# EasyEDA Pro project AB_Register.eprj

# Schematic Schematic2
Board Name: Board2; Create Date: 2025-08-15; Page Name: P1; Project Name: AB_Register; Schematic Name: Schematic2; Update Date: 2025-08-15; Company: EasyEDA.com; Page Size: A4; Version: V1.0
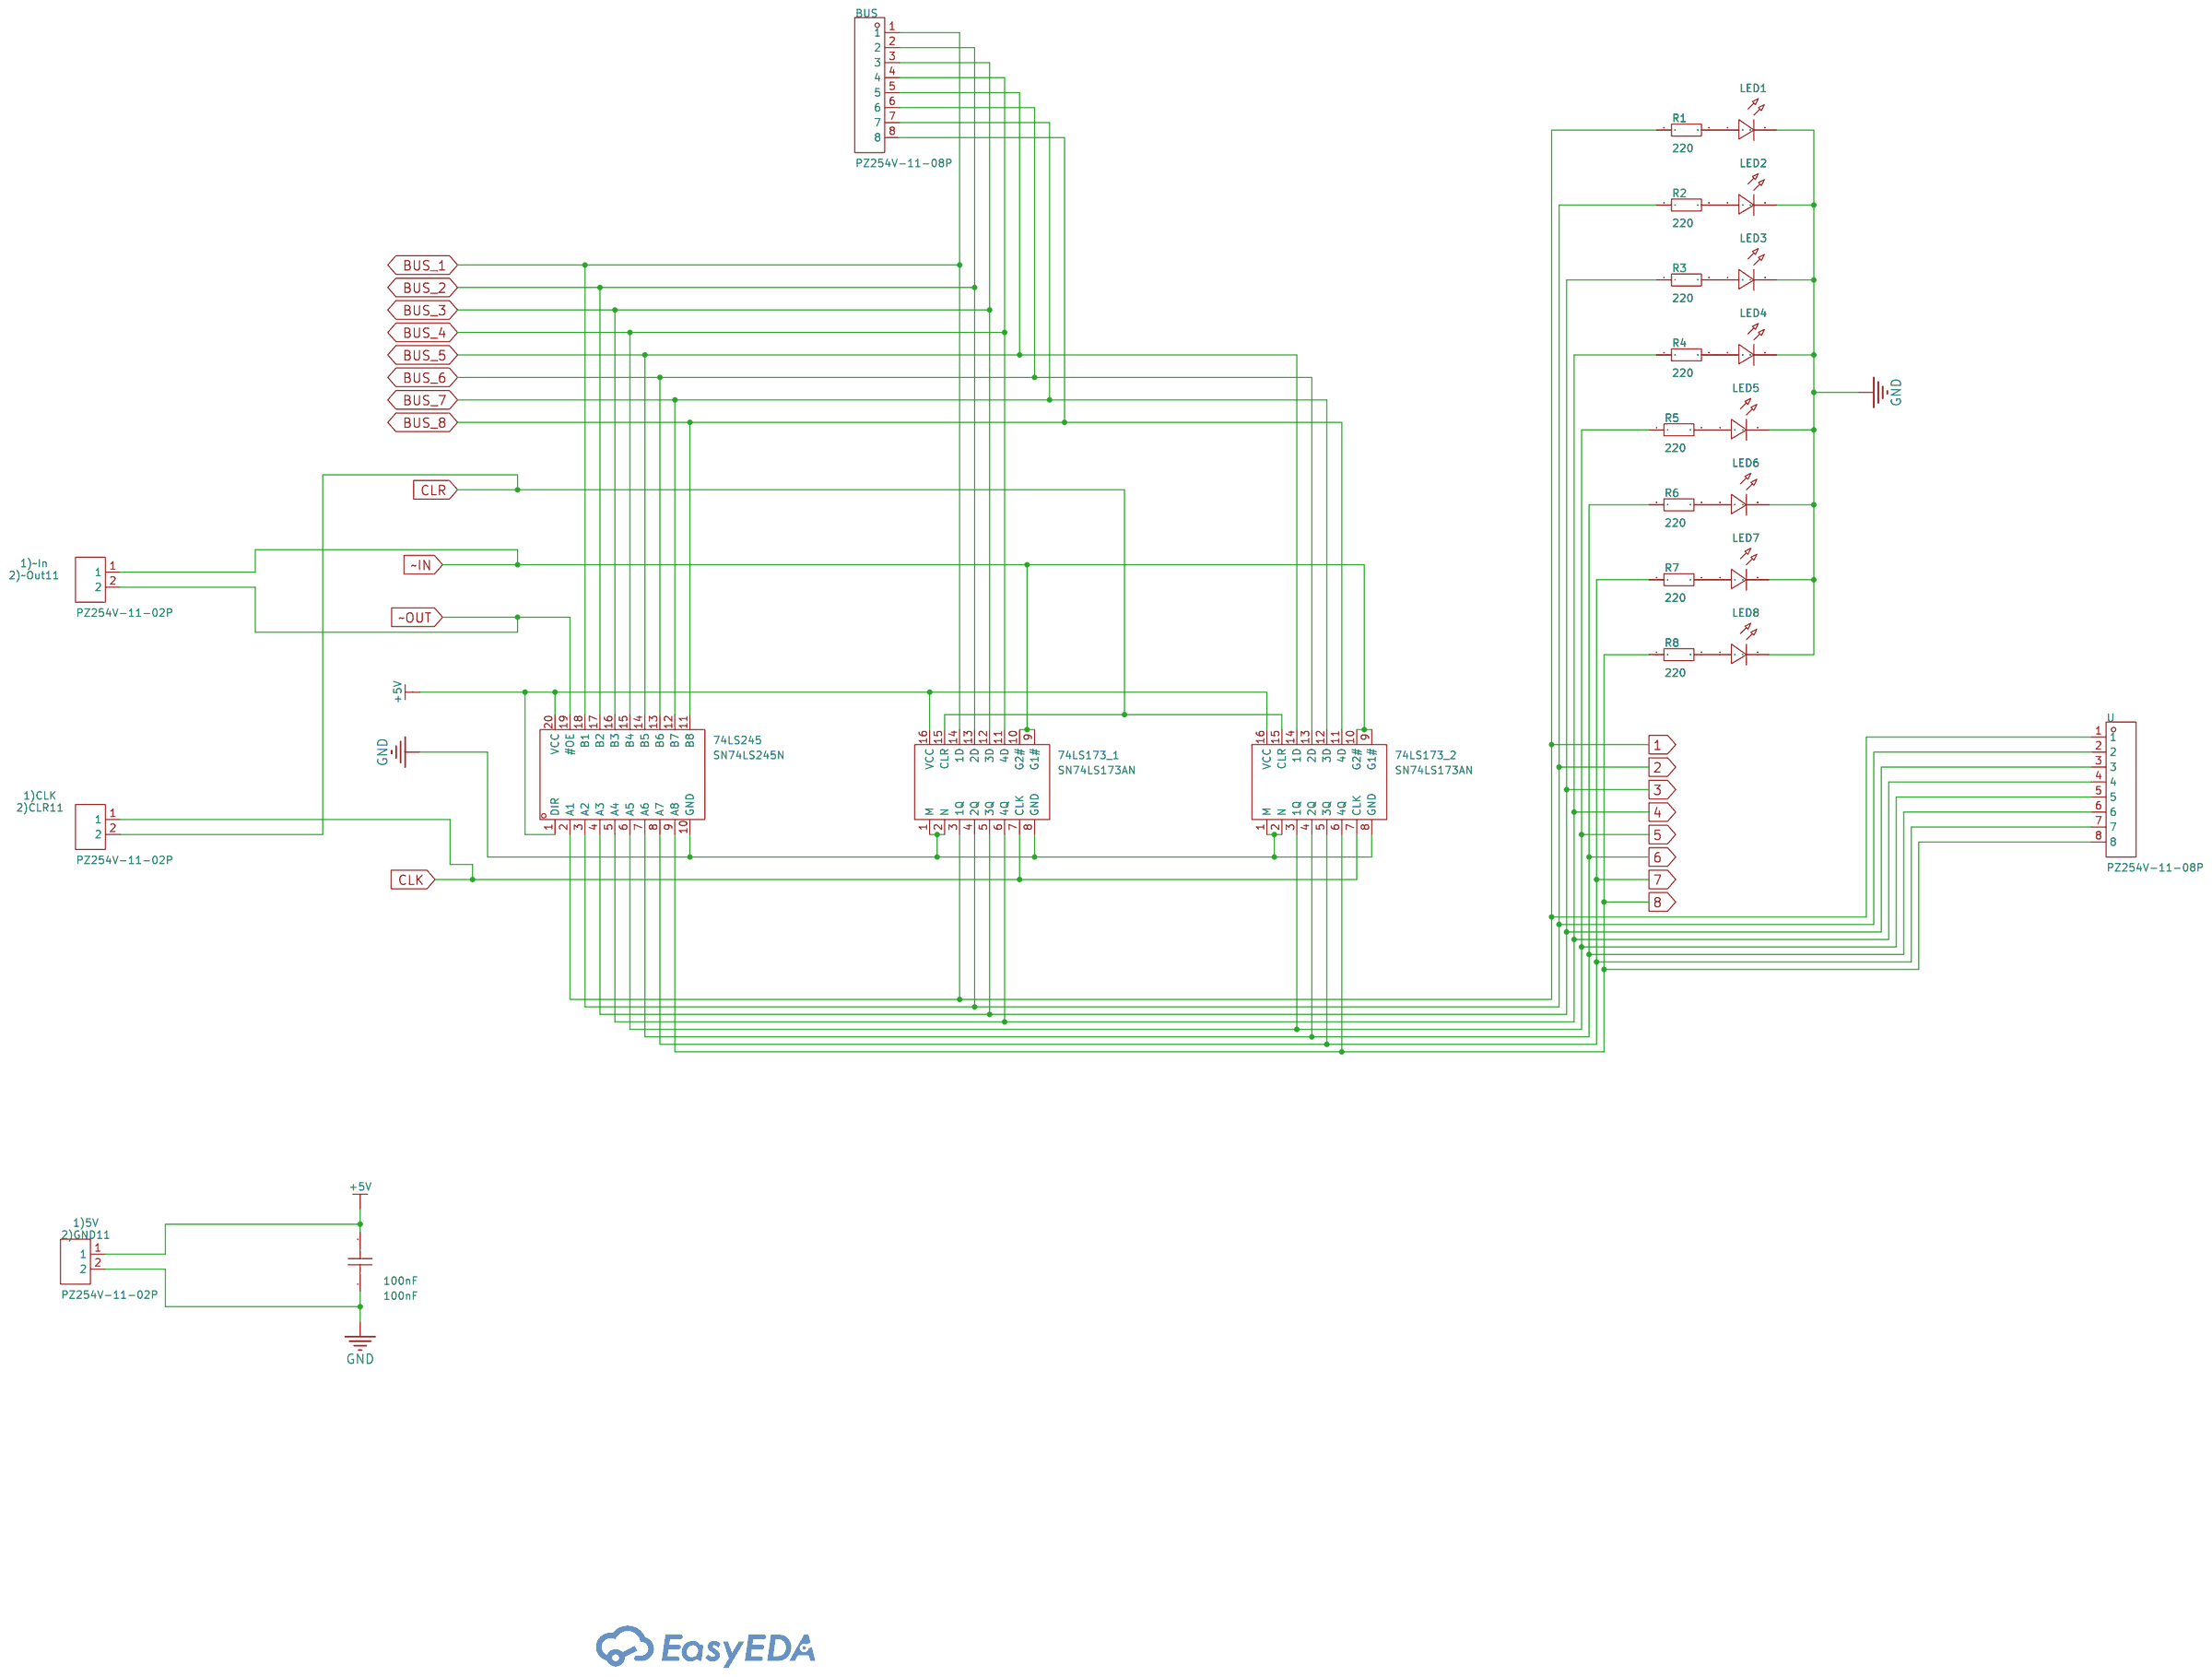
[diagram p0: schematic sheet]

## Parts
1)5V
2)GND11  PZ254V-11-02P  [HDR-TH_2P-P2.54-V-M]
1)CLK
2)CLR11  PZ254V-11-02P  [HDR-TH_2P-P2.54-V-M]
1)~In
2)~Out11  PZ254V-11-02P  [HDR-TH_2P-P2.54-V-M]
74LS173_1  SN74LS173AN  [PDIP-16_L19.3-W6.4-P2.54-LS7.94-BL]
74LS173_2  SN74LS173AN  [PDIP-16_L19.3-W6.4-P2.54-LS7.94-BL]
74LS245  SN74LS245N  [DIP-20_L25.5-W10.0-P2.54-LS7.6-BL]
100nF  100nF  [CAP-TH_L8.5-W5.0-P5.00-D1.2]
BUS  PZ254V-11-08P  [HDR-TH_8P-P2.54-V-M]
LED1  -  [LED-TH_BD5.8-P2.54-FD]
LED2  -  [LED-TH_BD5.8-P2.54-FD]
LED3  -  [LED-TH_BD5.8-P2.54-FD]
LED4  -  [LED-TH_BD5.8-P2.54-FD]
LED5  -  [LED-TH_BD5.8-P2.54-FD]
LED6  -  [LED-TH_BD5.8-P2.54-FD]
LED7  -  [LED-TH_BD5.8-P2.54-FD]
LED8  -  [LED-TH_BD5.8-P2.54-FD]
R1  220  [R_AXIAL-0.4]
R2  220  [R_AXIAL-0.4]
R3  220  [R_AXIAL-0.4]
R4  220  [R_AXIAL-0.4]
R5  220  [R_AXIAL-0.4]
R6  220  [R_AXIAL-0.4]
R7  220  [R_AXIAL-0.4]
R8  220  [R_AXIAL-0.4]
U  PZ254V-11-08P  [HDR-TH_8P-P2.54-V-M]

## Library data of the parts
1)5V
2)GND11 1)CLK
2)CLR11 1)~In
2)~Out11 = PZ254V-11-02P: Pin Structure:1x2P Pitch:2.54mm Row Spacing:- Circluar Pins/Square Pins:Policy Mounting Type:Straight Number of Rows:Single Row Number of Pins:2P Current Rating:- Voltage Rating (Max):- Length of Mating Pin:6mm Insulation Height:2.5mm Length of End Connec; LCSC Part Name: 1x2P 间距:2.54mm 方针 直插; Supplier Part: C492401; Manufacturer: XFCN(兴飞); Supplier Footprint: 插件,P=2.54mm; JLCPCB Part Class: Extended Part; Datasheet: https://atta.szlcsc.com/upload/public/pdf/source/20200309/C492401_A812433581A9B211A7FFA413ADDFF0E5.pdf; Supplier: LCSC; Pin Structure: 1x2P; Pitch: 2.54mm; Circluar Pins/Square Pins: Policy; Mounting Type: Straight; Number of Rows: Single Row; Number of Pins: 2P; Length of Mating Pin: 6mm; Insulation Height: 2.5mm; Length of End Connection Pin: 3mm; Contact Material: Brass; Operating Temperature: -40℃~+105℃; Color: Black
74LS173_1 74LS173_2 = SN74LS173AN: Type:D-Type Trigger Type:Rising Edge Voltage - Supply:4.75V~5.25V Voltage - Supply:4.75V~5.25V Clock Frequency:50MHz Function:Reset Number of Elements:1 Number of Bits per Element:4 Output Type:- Propagation Delay:30ns@5V,45pF Series:74LS Series Current -; Supplier Part: C1550125; Manufacturer: TI(德州仪器); Supplier Footprint: PDIP-16; JLCPCB Part Class: Extended Part; Datasheet: https://www.ti.com/cn/lit/gpn/sn74ls173a; Supplier: LCSC; Type: D-Type; Trigger Type: Rising Edge; Voltage - Supply: 4.75V~5.25V; Clock Frequency: 50MHz; Function: Reset; Number of Elements: 1; Number of Bits per Element: 4; Propagation Delay: 30ns@5V,45pF; Series: 74LS Series; Current - Output Low(IOL): 24mA; Current - Output High(IOH): 2.6mA; Quiescent Current: 24mA; Operating Temperature: 0℃~+70℃
74LS245 = SN74LS245N: output type:Tri-State Voltage - Supply:4.75V~5.25V Voltage - Supply:4.75V~5.25V Number of Elements:1 Number of Bits per Element:8 Current - Output Low(IOL):24mA Current - Output High(IOH):15mA Logic Family:74LS Operating Temperature:0℃~+70℃ Operating Temp; Supplier Part: C352966; Manufacturer: TI(德州仪器); Supplier Footprint: DIP-20; JLCPCB Part Class: Extended Part; Datasheet: https://www.ti.com/cn/lit/gpn/sn74ls245; Supplier: LCSC; output type: Tri-State; Voltage - Supply: 4.75V~5.25V; Number of Elements: 1; Number of Bits per Element: 8; Current - Output Low(IOL): 24mA; Current - Output High(IOH): 15mA; Logic Family: 74LS; Operating Temperature: 0℃~+70℃
100nF = CT4-0805B104K500F3: Capacitance:100nF Tolerance:±10% Tolerance:±10% Voltage Rated: Temperature Coefficient:; LCSC Part Name: 100nF ±10% 50V C3型（直脚）; Supplier Part: C84772; Manufacturer: FH(风华); Supplier Footprint: 插件,P=5.08mm; JLCPCB Part Class: Extended Part; Datasheet: https://atta.szlcsc.com/upload/public/pdf/source/20190402/C385200_059806A6312B28FF1421A2413EB641E1.pdf; Supplier: LCSC; Tolerance: ±10%
BUS U = PZ254V-11-08P: Pin Structure:1x8P Pitch:2.54mm Row Spacing:- Circluar Pins/Square Pins:Square Pins Mounting Type:Straight Number of Rows:Plugin Number of Pins:8P Current Rating (Max):- Voltage Rating (Max):- Length of Mating Pin:6mm Insulation Height:2.5mm Length of End; LCSC Part Name: 间距:2.54mm 1x8P 直插 方针; Supplier Part: C492407; Manufacturer: XFCN(兴飞); Supplier Footprint: 插件,P=2.54mm; JLCPCB Part Class: Extended Part; Datasheet: https://atta.szlcsc.com/upload/public/pdf/source/20200309/C492407_83A6FB26A2233368EDB9516968EC6149.pdf; Supplier: LCSC; Pin Structure: 1x8P; Pitch: 2.54mm; Circluar Pins/Square Pins: Square Pins; Mounting Type: Straight; Number of Rows: Plugin; Number of Pins: 8P; Length of Mating Pin: 6mm; Insulation Height: 2.5mm; Length of End Connection Pin: 3mm; Operating Temperature Range: -40℃~+105℃; Color: Black
LED1-LED8 = LED_TH-R_5mm: Supplier Footprint: Through
R1-R8 = Res_AXIAL-1/4W: Supplier Footprint: Through

## Nets
+5V: 1)5V
2)GND11.1 74LS173_1.16(VCC) 74LS173_2.16(VCC) 74LS245.1(DIR) 74LS245.20(VCC) 100nF.1
GND: 1)5V
2)GND11.2 74LS173_1.1(M) 74LS173_1.2(N) 74LS173_1.8(GND) 74LS173_2.1(M) 74LS173_2.2(N) 74LS173_2.8(GND) 74LS245.10(GND) 100nF.2 LED1.2(A) LED2.2(A) LED3.2(A) LED4.2(A) LED5.2(A) LED6.2(A) LED7.2(A) LED8.2(A)
1: 74LS173_1.3(1Q) 74LS245.2(A1) R1.1 U.1
2: 74LS173_1.4(2Q) 74LS245.3(A2) R2.1 U.2
3: 74LS173_1.5(3Q) 74LS245.4(A3) R3.1 U.3
4: 74LS173_1.6(4Q) 74LS245.5(A4) R4.1 U.4
5: 74LS173_2.3(1Q) 74LS245.6(A5) R5.1 U.5
6: 74LS173_2.4(2Q) 74LS245.7(A6) R6.1 U.6
7: 74LS173_2.5(3Q) 74LS245.8(A7) R7.1 U.7
8: 74LS173_2.6(4Q) 74LS245.9(A8) R8.1 U.8
BUS_1: 74LS173_1.14(1D) 74LS245.18(B1) BUS.1
BUS_2: 74LS173_1.13(2D) 74LS245.17(B2) BUS.2
BUS_3: 74LS173_1.12(3D) 74LS245.16(B3) BUS.3
BUS_4: 74LS173_1.11(4D) 74LS245.15(B4) BUS.4
BUS_5: 74LS173_2.14(1D) 74LS245.14(B5) BUS.5
BUS_6: 74LS173_2.13(2D) 74LS245.13(B6) BUS.6
BUS_7: 74LS173_2.12(3D) 74LS245.12(B7) BUS.7
BUS_8: 74LS173_2.11(4D) 74LS245.11(B8) BUS.8
CLK: 1)CLK
2)CLR11.1 74LS173_1.7(CLK) 74LS173_2.7(CLK)
CLR: 1)CLK
2)CLR11.2 74LS173_1.15(CLR) 74LS173_2.15(CLR)
~IN: 1)~In
2)~Out11.1 74LS173_1.9(G1#) 74LS173_1.10(G2#) 74LS173_2.9(G1#) 74LS173_2.10(G2#)
~OUT: 1)~In
2)~Out11.2 74LS245.19(#OE)
$1N2512: LED1.1(C) R1.2
$1N2521: LED8.1(C) R8.2
$1N2522: LED7.1(C) R7.2
$1N2523: LED6.1(C) R6.2
$1N2524: LED5.1(C) R5.2
$1N2525: LED4.1(C) R4.2
$1N2526: LED3.1(C) R3.2
$1N2527: LED2.1(C) R2.2

# Board PCB2
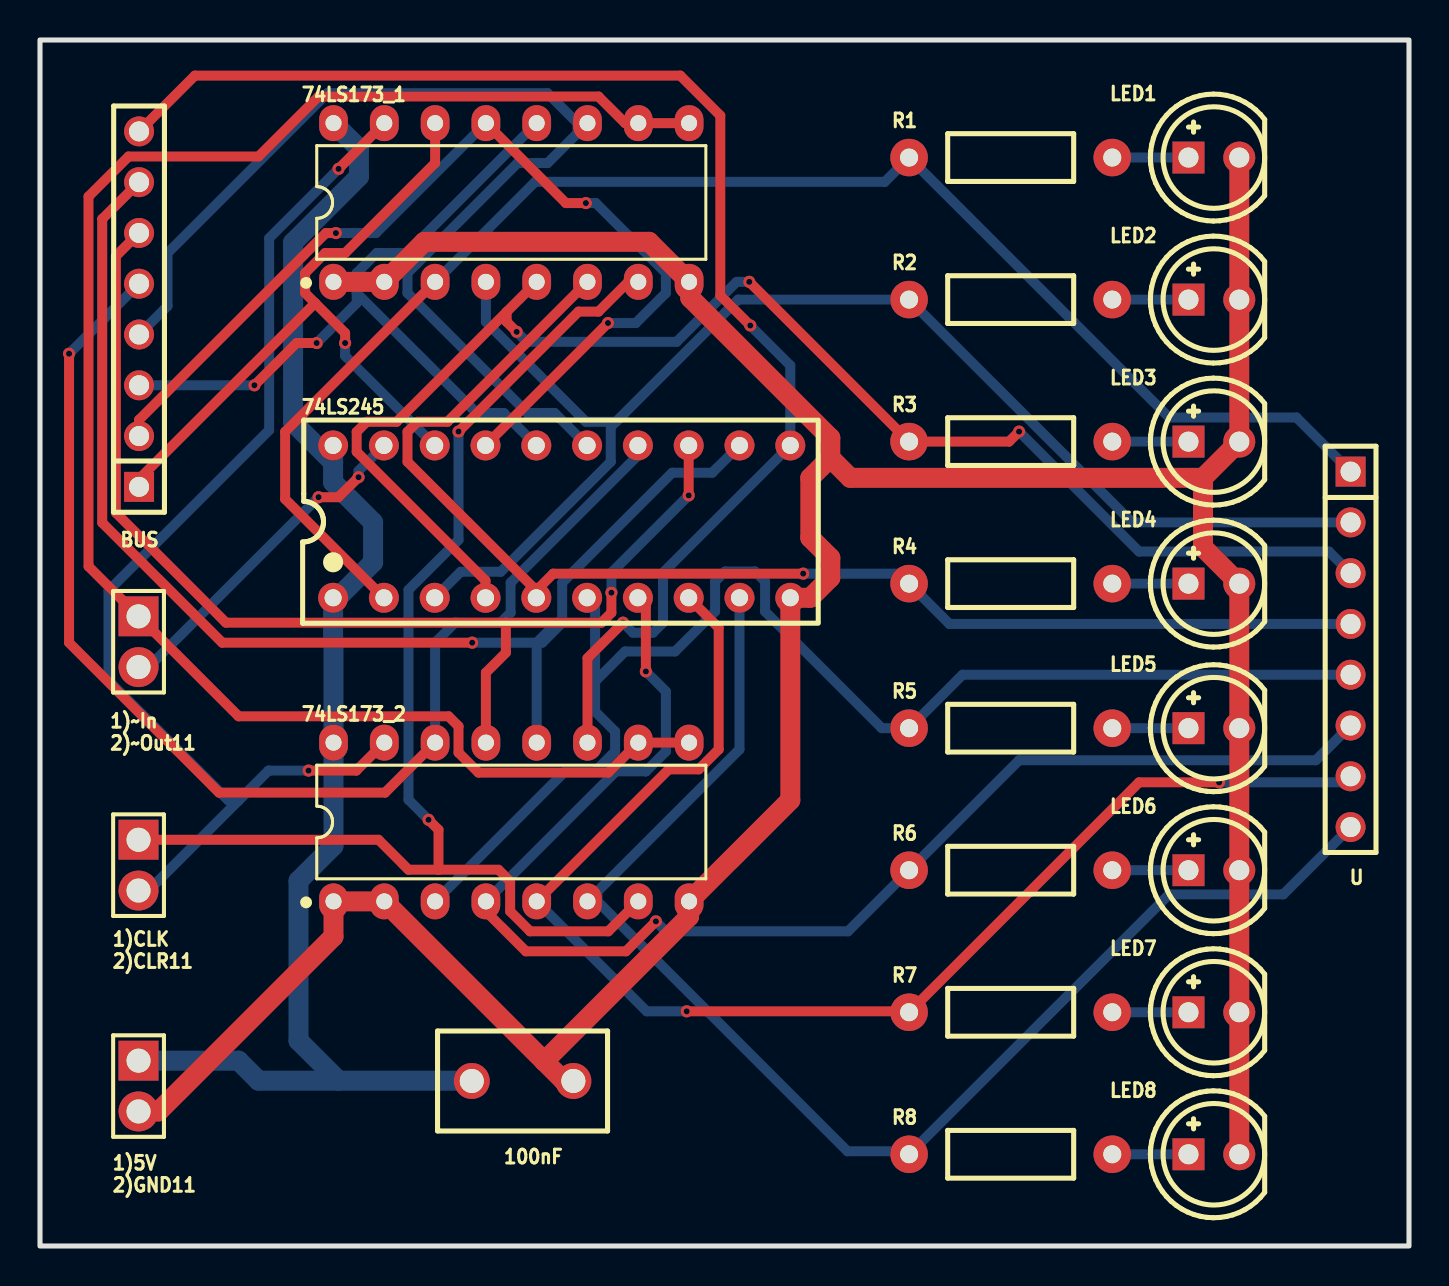
[diagram p1: board, top side]
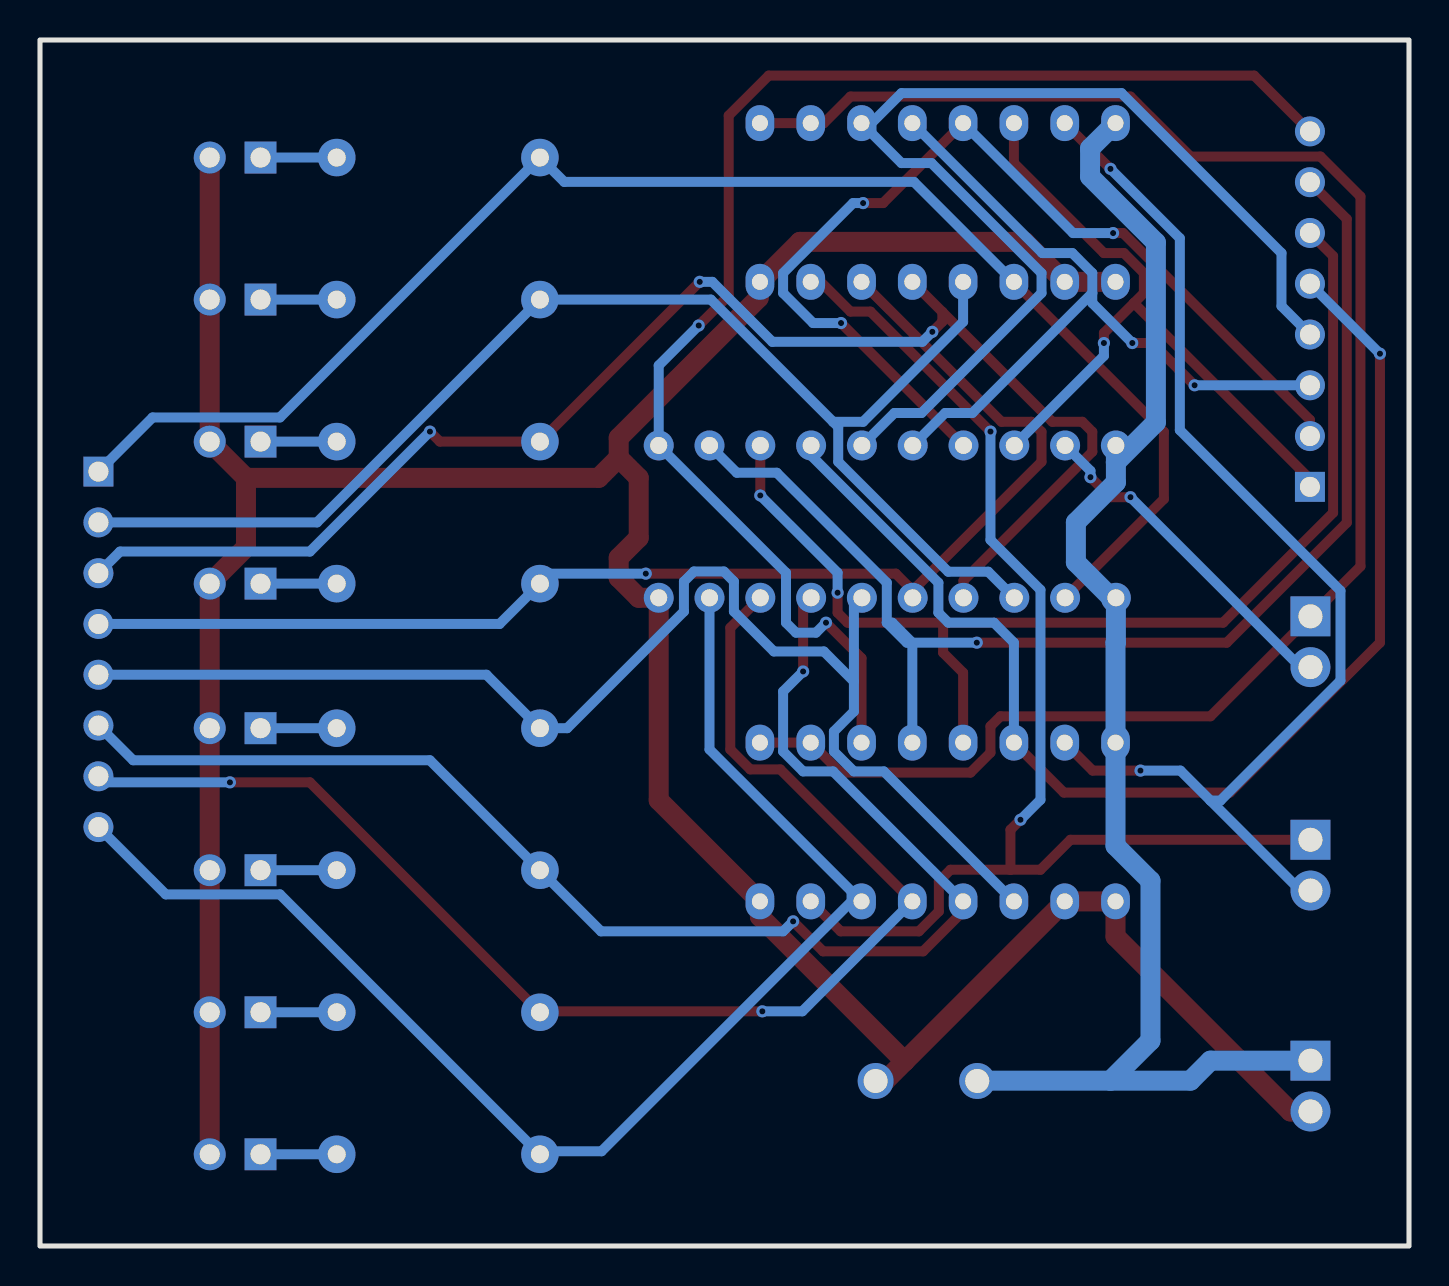
[diagram p2: board, bottom side, seen from below]

Outline 68.45 x 60.33 mm; copper layers: Top Layer, Bottom Layer. Coordinates in mm from the lower left corner of the outline.
Outline path: rectangle 0,60.33 68.45,0
Stack: Top Layer 0.035mm / Dielectric1 1.51mm FR4 er 4.5 / Bottom Layer 0.035mm

## Design rules (mm)
template: Custom Config
spacing copperThickness1oz (default): track to track 0.102, other pairs 0.152 to 0.3
spacing copperThickness2oz: track to track 0.203, other pairs 0.152 to 0.3
track width copperThickness1oz (default): min 0.127, default 0.5, max 2.54
track width copperThickness2oz: min 0.127, default 1, max 2.54
differential pair differentialPair (default): width min 0.127, default 0.254, max 2.54; gap min 0.152, default 0.152
via viaSize (default): diameter min 0.5, default 0.61, max 10; hole min 0.3, default 0.305, max 6.3
net +5V uses copperThickness2oz
net GND uses copperThickness2oz

## Placement (name value [footprint] x y rotation side)
1)5V
2)GND11  PZ254V-11-02P  [HDR-TH_2P-P2.54-V-M]  4.93 8 270 top
1)CLK
2)CLR11  PZ254V-11-02P  [HDR-TH_2P-P2.54-V-M]  4.93 19.05 270 top
1)~In
2)~Out11  PZ254V-11-02P  [HDR-TH_2P-P2.54-V-M]  4.93 30.23 270 top
74LS173_1  SN74LS173AN  [PDIP-16_L19.3-W6.4-P2.54-LS7.94-BL]  23.57 52.2 0 top
74LS173_2  SN74LS173AN  [PDIP-16_L19.3-W6.4-P2.54-LS7.94-BL]  23.57 21.21 0 top
74LS245  SN74LS245N  [DIP-20_L25.5-W10.0-P2.54-LS7.6-BL]  26.09 36.23 0 top
100nF  100nF  [CAP-TH_L8.5-W5.0-P5.00-D1.2]  24.13 8.25 0 top
BUS  PZ254V-11-08P  [HDR-TH_8P-P2.54-V-M]  4.95 46.86 90 top
LED1  -  [LED-TH_BD5.8-P2.54-FD]  58.7 54.44 0 top
LED2  -  [LED-TH_BD5.8-P2.54-FD]  58.7 47.34 0 top
LED3  -  [LED-TH_BD5.8-P2.54-FD]  58.7 40.24 0 top
LED4  -  [LED-TH_BD5.8-P2.54-FD]  58.7 33.13 0 top
LED5  -  [LED-TH_BD5.8-P2.54-FD]  58.7 25.9 0 top
LED6  -  [LED-TH_BD5.8-P2.54-FD]  58.7 18.8 0 top
LED7  -  [LED-TH_BD5.8-P2.54-FD]  58.7 11.69 0 top
LED8  -  [LED-TH_BD5.8-P2.54-FD]  58.7 4.59 0 top
R1  220  [R_AXIAL-0.4]  48.54 54.44 0 top
R2  220  [R_AXIAL-0.4]  48.54 47.34 0 top
R3  220  [R_AXIAL-0.4]  48.54 40.24 0 top
R4  220  [R_AXIAL-0.4]  48.54 33.13 0 top
R5  220  [R_AXIAL-0.4]  48.54 25.9 0 top
R6  220  [R_AXIAL-0.4]  48.54 18.8 0 top
R7  220  [R_AXIAL-0.4]  48.54 11.69 0 top
R8  220  [R_AXIAL-0.4]  48.54 4.59 0 top
U  PZ254V-11-08P  [HDR-TH_8P-P2.54-V-M]  65.53 29.84 270 top

## Footprints (pads in the part's own frame, mm; a bottom-side part is the same pattern mirrored in y, then rotated)
CAP-TH_L8.5-W5.0-P5.00-D1.2
  round 1.8 hole 1.2: 1(-2.54,0) 2(2.54,0)
DIP-20_L25.5-W10.0-P2.54-LS7.6-BL
  round 1.5 hole 0.85: 1(-11.43,-3.81) 2(-8.89,-3.81) 3(-6.35,-3.81) 4(-3.81,-3.81) 5(-1.27,-3.81) 6(1.27,-3.81) 7(3.81,-3.81) 8(6.35,-3.81) 9(8.89,-3.81) 10(11.43,-3.81) 11(11.43,3.81) 12(8.89,3.81) 13(6.35,3.81) 14(3.81,3.81) 15(1.27,3.81) 16(-1.27,3.81) 17(-3.81,3.81) 18(-6.35,3.81) 19(-8.89,3.81) 20(-11.43,3.81)
HDR-TH_2P-P2.54-V-M
  rect 2x2 hole 1.2: 1(-1.27,0)
  round 2 hole 1.2: 2(1.27,0)
HDR-TH_8P-P2.54-V-M
  rect 1.5x1.5 hole 1: 1(-8.89,0)
  round 1.5 hole 1: 2(-6.35,0) 3(-3.81,0) 4(-1.27,0) 5(1.27,0) 6(3.81,0) 7(6.35,0) 8(8.89,0)
LED-TH_BD5.8-P2.54-FD
  rect 1.6x1.6 hole 1: 1(-1.27,0)
  round 1.6 hole 1: 2(1.27,0)
PDIP-16_L19.3-W6.4-P2.54-LS7.94-BL
  oval 1.44x1.8 hole 0.8: 1(-8.89,-3.97) 2(-6.35,-3.97) 3(-3.81,-3.97) 4(-1.27,-3.97) 5(1.27,-3.97) 6(3.81,-3.97) 7(6.35,-3.97) 8(8.89,-3.97) 9(8.89,3.97) 10(6.35,3.97) 11(3.81,3.97) 12(1.27,3.97) 13(-1.27,3.97) 14(-3.81,3.97) 15(-6.35,3.97) 16(-8.89,3.97)
R_AXIAL-0.4
  round 1.879 hole 0.899: 1(-5.08,0) 2(5.08,0)

## Nets
As in the schematic.

## Via types
v1: diameter 0.61, hole 0.305, Top Layer to Bottom Layer, 26 vias

## Routing (per net, layer and track width the routed paths; a pad name or vN(x,y) marks a point on that pad's centre or on a via; arc(x,y) is an arc through that point)
+5V: length 72
  Bottom Layer w1: 14.93,8.27 21.57,8.27 100nF.1 ; 14.93,8.27 10.93,8.27 9.93,9.27 1)5V
2)GND11.1 ; 14.93,8.27 12.93,10.27 12.93,18.27 14.68,20.02 74LS173_2.16 14.68,30.18 14.66,30.2 14.66,32.2 ; 14.66,32.2 74LS245.1 ; 14.66,32.2 16.66,34.2 16.66,36.2 14.66,38.2 14.66,39.2 ; 74LS173_1.16 15.95,54.9 15.95,53.49 12.66,50.2 12.66,41.2 14.66,39.2 ; 14.66,39.2 74LS245.20
GND: length 169.9
  Top Layer w1: LED8.2 LED7.2 LED6.2 LED5.2 LED4.2 58.15,34.94 58.15,38.42 ; LED1.2 LED2.2 LED3.2 58.15,38.42 ; 25.22,9.24 74LS173_2.2 74LS173_2.1 14.68,15.48 5.93,6.73 1)5V
2)GND11.2 ; 25.22,9.24 26.2,8.25 100nF.2 ; 25.22,9.24 32.46,16.48 74LS173_2.8 37.52,22.3 74LS245.10 38.52,32.42 39.52,33.42 39.52,34.42 38.52,35.42 38.52,38.42 39.52,39.42 ; 58.15,38.42 40.52,38.42 39.52,39.42 ; 39.52,39.42 39.52,40.42 32.52,47.42 32.52,48.17 74LS173_1.8 30.46,50.23 19.22,50.23 74LS173_1.2 74LS173_1.1
1: length 75.8
  Top Layer w0.5: 74LS245.2 12.26,37.36 12.26,40.73 74LS173_1.3
  Bottom Layer w0.5: 74LS173_1.3 24.76,53.23 42.24,53.23 R1.1 56.46,41.44 62.82,41.44 U.1
2: length 68.2
  Bottom Layer w0.5: 28.8,41.23 28.54,40.97 28.54,39.23 23.04,33.73 21.04,33.73 74LS245.3 ; 28.8,41.23 34.91,47.34 R2.1 54.6,36.19 U.2 ; 28.8,41.23 27.3,41.23 22.3,46.23 74LS173_1.4
3: length 73.9
  Top Layer w0.5: v1(23.84,45.73) 23.34,46.23 23.34,46.73 ; 23.34,46.73 17.84,41.23 16.34,41.23 15.84,40.73 15.84,39.73 22.28,33.29 74LS245.4 ; 23.34,46.73 74LS173_1.5 ; v1(35.46,48.23) R3.1 48.46,40.24 v1(48.96,40.74)
  Bottom Layer w0.5: v1(48.96,40.74) 54.96,34.74 64.45,34.74 U.3 ; v1(35.46,48.23) 34.84,48.23 31.84,45.23 24.34,45.23 v1(23.84,45.73)
4: length 65.2
  Top Layer w0.5: 74LS173_1.6 20.38,41.23 18.88,41.23 18.38,40.73 18.38,39.23 24.82,32.79 ; 24.82,32.79 74LS245.5 ; 24.82,32.79 25.66,33.63 v1(38.16,33.63)
  Bottom Layer w0.5: U.4 45.47,31.11 R4.1 42.96,33.63 v1(38.16,33.63)
5: length 66.5
  Bottom Layer w0.5: 27.76,28.24 29.26,29.74 31.76,29.74 33.76,31.74 33.76,33.24 34.26,33.74 35.76,33.74 36.26,33.24 36.26,31.74 42.09,25.9 R5.1 46.13,28.58 U.5 ; 27.76,28.24 27.76,26.74 28.76,25.74 28.76,24.74 27.76,23.74 26.26,23.74 74LS173_2.3 ; 27.76,28.24 27.76,32.02 74LS245.6
6: length 70
  Top Layer w0.5: v1(30.8,16.24) 29.3,14.74 24.3,14.74 22.3,16.74 74LS173_2.4 ; v1(30.3,28.74) 30.3,32.02 74LS245.7
  Bottom Layer w0.5: 74LS173_2.4 28.8,23.74 30.3,23.74 31.3,24.74 31.3,27.74 v1(30.3,28.74) ; U.6 63.79,24.3 48.96,24.3 R6.1 40.4,15.74 31.3,15.74 v1(30.8,16.24)
7: length 68.3
  Top Layer w0.5: 74LS245.8 33.94,30.92 33.94,24.84 32.94,23.84 31.44,23.84 74LS173_2.5 ; v1(58.96,23.19) 54.96,23.19 R7.1 43.41,11.74 v1(32.34,11.74)
  Bottom Layer w0.5: 74LS173_2.5 30.34,11.74 v1(32.34,11.74) ; v1(58.96,23.19) 65.23,23.19 U.7
8: length 68.5
  Bottom Layer w0.5: U.8 62.17,17.59 56.46,17.59 R8.1 43.31,4.74 40.38,4.74 27.88,17.24 27.88,17.74 ; 27.88,17.74 74LS173_2.6 ; 27.88,17.74 34.98,24.84 74LS245.9
BUS_1: length 34.9
  Top Layer w0.5: 13.76,47.17 15.26,45.67 v1(15.26,45.17) ; 13.76,47.17 4.95,38.36 BUS.1 ; 13.76,47.17 13.26,47.67 13.26,48.67 14.26,49.67 15.26,49.67 19.76,54.17 74LS173_1.14
  Bottom Layer w0.5: v1(15.26,45.17) 15.26,44.52 74LS245.18
BUS_2: length 49.6
  Top Layer w0.5: v1(27.3,52.17) 26.3,52.17 74LS173_1.13 ; v1(14.8,50.67) 14.3,50.67 4.95,41.32 BUS.2 ; v1(28.4,46.17) 74LS245.17
  Bottom Layer w0.5: v1(27.3,52.17) 27.8,52.17 31.3,48.67 31.3,47.67 29.8,46.17 v1(28.4,46.17) ; v1(14.8,50.67) 16.8,50.67 74LS173_1.13
BUS_3: length 38.3
  Top Layer w0.5: v1(10.72,43.05) 12.84,45.17 v1(13.84,45.17)
  Bottom Layer w0.5: 15.84,47.67 15.84,48.67 16.84,49.67 18.34,49.67 74LS173_1.12 ; 15.84,47.67 21.84,41.67 23.19,41.67 74LS245.16 ; 15.84,47.67 15.84,47.17 v1(13.84,45.17) ; v1(10.72,43.05) BUS.3
BUS_4: length 54.8
  Bottom Layer w0.5: 74LS173_1.11 26.88,55.67 ; 26.88,55.67 26.88,56.17 25.38,57.67 14.38,57.67 6.38,49.67 6.38,47.02 BUS.4 ; 26.88,55.67 25.38,54.17 23.88,54.17 18.38,48.67 18.38,47.67 24.38,41.67 25.73,41.67 74LS245.15
BUS_5: length 62.2
  Top Layer w0.5: v1(1.45,44.63) 1.45,30.18 8.95,22.68 17.26,22.68 74LS173_2.14
  Bottom Layer w0.5: v1(1.45,44.63) BUS.5 ; 74LS173_2.14 19.76,30.18 20.76,31.18 23.03,31.18 23.53,31.68 23.53,33.18 29.9,39.54 74LS245.14
BUS_6: length 58.1
  Top Layer w0.5: BUS.6 3.8,49.52 3.8,36.68 9.3,31.18 23.3,31.18 ; 23.3,31.18 23.3,29.68 22.3,28.68 74LS173_2.13 ; 23.3,31.18 28.07,31.18 28.57,31.68 v1(28.57,32.68) ; v1(32.44,37.54) 74LS245.13
  Bottom Layer w0.5: v1(28.57,32.68) 28.57,33.68 v1(32.44,37.54)
BUS_7: length 64.1
  Top Layer w0.5: v1(21.61,30.18) 9.11,30.18 3.11,36.18 3.11,51.37 BUS.7
  Bottom Layer w0.5: 24.84,30.18 v1(21.61,30.18) ; 24.84,30.18 74LS173_2.12 ; 24.84,30.18 25.11,30.18 26.11,31.18 ; 24.84,30.18 25.84,31.18 26.11,31.18 ; 74LS245.12 33.61,38.68 31.61,38.68 26.11,33.18 26.11,31.18
BUS_8: length 69.6
  Top Layer w0.5: BUS.8 7.74,58.54 32.02,58.54 34.02,56.54 34.02,47.54 v1(35.52,46.04) ; 74LS173_2.11 27.38,29.4 v1(29.15,31.18)
  Bottom Layer w0.5: v1(35.52,46.04) 37.52,44.04 74LS245.11 31.15,33.68 31.15,31.18 30.65,30.68 29.65,30.68 v1(29.15,31.18)
CLK: length 64.1
  Top Layer w0.5: 19.93,18.82 19.93,20.82 v1(19.43,21.32) ; 19.93,18.82 22.93,18.82 23.51,18.24 23.51,16.74 24.51,15.74 28.42,15.74 74LS173_2.7 ; 19.93,18.82 18.43,18.82 16.93,20.32 1)CLK
2)CLR11.1 ; v1(20.93,40.74) 26.93,46.74 27.93,46.74 29.42,48.23 74LS173_1.7
  Bottom Layer w0.5: v1(19.43,21.32) 18.43,22.32 18.43,32.82 20.93,35.32 v1(20.93,40.74)
CLR: length 57.9
  Top Layer w0.5: 74LS173_2.15 15.82,23.78 v1(13.43,23.78) ; v1(14.93,53.88) 74LS173_1.15
  Bottom Layer w0.5: 9.93,22.28 5.43,17.78 1)CLK
2)CLR11.2 ; 9.93,22.28 11.43,23.78 v1(13.43,23.78) ; 9.93,22.28 9.43,22.28 3.43,28.28 3.43,32.78 11.46,40.81 11.46,50.41 v1(14.93,53.88)
~IN: length 86.8
  Top Layer w0.5: 74LS173_2.9 74LS173_2.10 28.42,23.68 21.93,23.68 20.93,24.68 20.93,26 20.43,26.5 9.93,26.5 1)~In
2)~Out11.1 2.43,34 2.43,52.5 4.43,54.5 10.93,54.5 13.93,57.5 27.93,57.5 29.26,56.17 74LS173_1.9
~OUT: length 17
  Top Layer w0.5: v1(13.93,37.46) 14.93,37.46 v1(15.93,38.46)
  Bottom Layer w0.5: v1(13.93,37.46) 5.43,28.96 1)~In
2)~Out11.2 ; 74LS245.19 15.93,38.77 v1(15.93,38.46)
$1N2512: length 3.8
  Bottom Layer w0.5: LED1.1 R1.2
$1N2521: length 3.8
  Bottom Layer w0.5: LED8.1 R8.2
$1N2522: length 3.8
  Bottom Layer w0.5: LED7.1 R7.2
$1N2523: length 3.8
  Bottom Layer w0.5: LED6.1 R6.2
$1N2524: length 3.8
  Bottom Layer w0.5: LED5.1 R5.2
$1N2525: length 3.8
  Bottom Layer w0.5: LED4.1 R4.2
$1N2526: length 3.8
  Bottom Layer w0.5: LED3.1 R3.2
$1N2527: length 3.8
  Bottom Layer w0.5: LED2.1 R2.2
